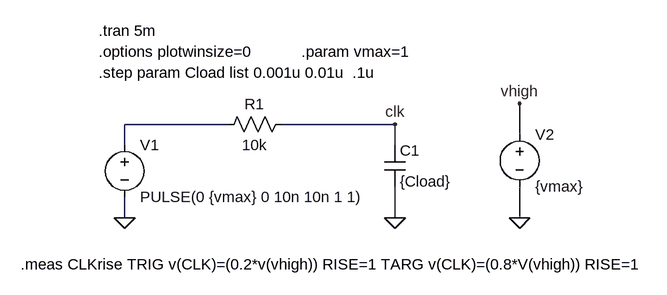
[diagram p0: schematic meas_raw1.asc]
meas_raw1.asc, the LTspice schematic file:
Version 4
SHEET 1 880 680
WIRE 48 176 -112 176
WIRE 304 176 128 176
WIRE 496 192 496 144
WIRE -112 208 -112 176
WIRE 304 208 304 176
WIRE -112 320 -112 288
WIRE 304 320 304 272
WIRE 496 320 496 272
FLAG -112 320 0
FLAG 304 320 0
FLAG 304 176 clk
FLAG 496 320 0
FLAG 496 144 vhigh
SYMBOL res 32 192 R270
WINDOW 0 32 56 VTop 0
WINDOW 3 0 56 VBottom 0
SYMATTR InstName R1
SYMATTR Value 10k
SYMBOL cap 288 208 R0
SYMATTR InstName C1
SYMATTR Value {Cload}
SYMBOL voltage -112 192 R0
WINDOW 123 0 0 Left 0
WINDOW 39 0 0 Left 0
SYMATTR InstName V1
SYMATTR Value PULSE(0 {vmax} 0 10n 10n 1 1)
SYMBOL voltage 496 176 R0
SYMATTR InstName V2
SYMATTR Value {vmax}
TEXT -152 32 Left 0 !.tran 5m
TEXT -152 64 Left 0 !.options plotwinsize=0
TEXT -272 392 Left 0 !.meas CLKrise TRIG v(CLK)=(0.2*v(vhigh)) RISE=1 TARG v(CLK)=(0.8*V(vhigh)) RISE=1
TEXT -152 96 Left 0 !.step param Cload list 0.001u 0.01u  .1u
TEXT 160 64 Left 0 !.param vmax=1

The netlist it stands for:
* meas_raw1.asc
R1 N001 clk 10k
C1 clk 0 {Cload}
V1 N001 0 PULSE(0 {vmax} 0 10n 10n 1 1)
V2 vhigh 0 {vmax}
.tran 5m
.options plotwinsize=0
.meas CLKrise TRIG v(CLK)=(0.2*v(vhigh)) RISE=1 TARG v(CLK)=(0.8*V(vhigh)) RISE=1
.step param Cload list 0.001u 0.01u  .1u
.param vmax=1
.backanno
.end